# Altium schematic sheet CONNECTORS.SchDoc
size A4; SheetNumber: 2; SheetTotal: 7
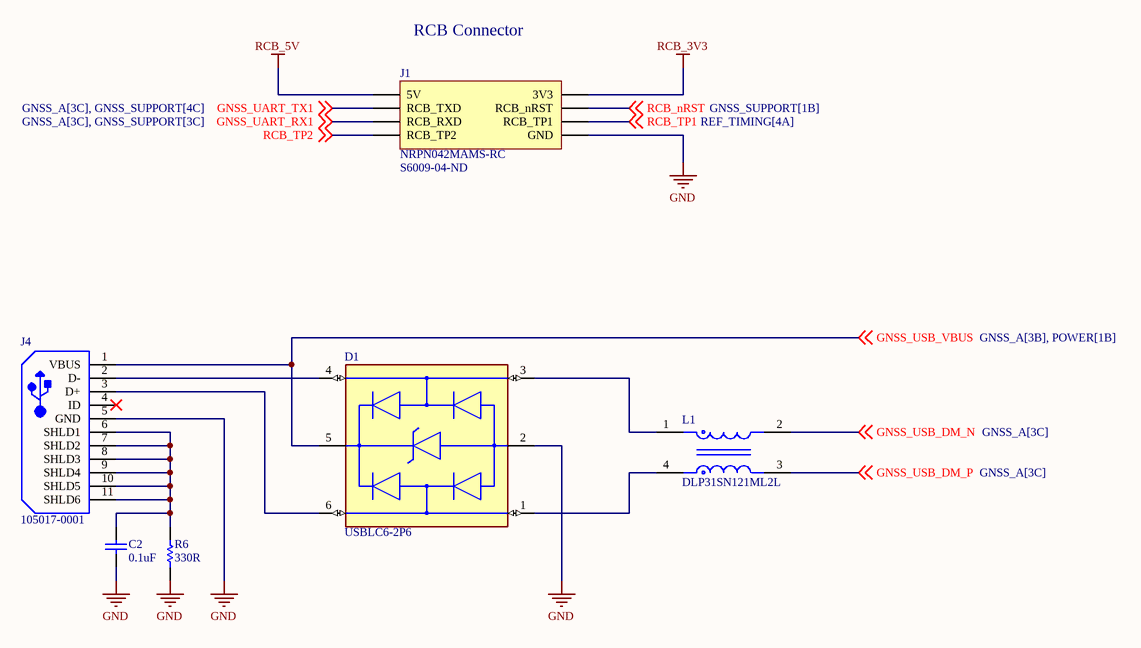
[diagram p0: CONNECTORS.SchDoc]

## Parts
C2  0.1uF  [CAPC1005X56X25LL10T15]
D1  USBLC6-2P6  [FP-SOT-666-MFG]
J1  NRPN042MAMS-RC  Supplier Part Number 1: S6009-04-ND  [NRPN042MAMS-RC]
J4  105017-0001  [USB-MICRO-B_V]
L1  DLP31SN121ML2L  [FP-DLP31SN-MFG]
R6  330R  [RESC1005X40X25ML05T05]

## Nets
GND: C2.1 D1.2(GND) J1.8(GND) J4.5(GND) R6.1
RCB_3V3: J1.2(3V3)
RCB_5V: J1.1(5V)
GNSS_UART_RX1: J1.5(RCB_RXD) ; off-sheet GNSS_UART_RX1
GNSS_UART_TX1: J1.3(RCB_TXD) ; off-sheet GNSS_UART_TX1
GNSS_USB_DM_N: L1.2 ; off-sheet GNSS_USB_DM_N
GNSS_USB_DM_P: L1.3 ; off-sheet GNSS_USB_DM_P
GNSS_USB_VBUS: D1.5(VBUS) J4.1(VBUS) ; off-sheet GNSS_USB_VBUS
RCB_nRST: J1.4(RCB_nRST) ; off-sheet RCB_nRST
RCB_TP1: J1.6(RCB_TP1) ; off-sheet RCB_TP1
RCB_TP2: J1.7(RCB_TP2) ; off-sheet RCB_TP2
NetC2_2: C2.2 J4.6(SHLD1) J4.7(SHLD2) J4.8(SHLD3) J4.9(SHLD4) J4.10(SHLD5) J4.11(SHLD6) R6.2
NetD1_1: D1.1(I/O1) L1.4
NetD1_3: D1.3(I/O2) L1.1
NetD1_4: D1.4(I/O2) J4.2(D-)
NetD1_6: D1.6(I/O1) J4.3(D+)

Not connected (* = marked no-connect by the designer): J4 4(ID)*

## Notes on the sheet
- RCB Connector

## Library data of the parts
C2 = CMP-2008-02743-1: Manufacturer: AVX Interconnect / Elco; Part Number: 04026D104KAT2A
D1 = CMP-12225-000058-1: TVS DIODE 5.25V 17V SOT666; Min Breakdown Voltage: 6V; Power Line Protection: Yes; Element Configuration: Dual; Test Current: 1mA; Working Voltage: 5V; Number of Channels: 2; Max Reverse Leakage Current: 150nA; Direction: Unidirectional; Peak Pulse Current: 5A; Number of Elements: 1; Capacitance: 3.5pF; Max Breakdown Voltage: 6V; Height: 0.6mm; Depth: 1.3mm; Contact Plating: Tin; Reverse Breakdown Voltage: 6V; REACH SVHC: No SVHC; Operating Supply Voltage: 5V; Width: 1.3mm; Max Operating Temperature: 125°C; Reverse Standoff Voltage: 5V; ESD Protection: Yes; Package Quantity: 1; Termination: SMD/SMT; Length: 1.7mm; Leakage Current: 150nA; Number of Bidirectional Channels: 2; Case/Package: SOT-666; Min Operating Temperature: -40°C; Number of Pins: 6; Clamping Voltage: 17V; Breakdown Voltage: 6V; Lead Free: Lead Free; Radiation Hardening: No; Packaging: Tape and Reel; Mount: Surface Mount; Polarity: Unidirectional
J1 = NRPN042MAMS-RC: Dual Row 8 Position 2 mm Pitch Surface Mount Header; Manufacturer: Sullins; Number of Positions: 8; Connector Type: Male Pin; Pitch: 0.079inch; Supplier 1: Digi-Key; Manufacturer Part Number: NRPN042MAMS-RC; RoHS: Yes; Category: Connectors; Stock 1: 10801; Pricing 1: 1=0.76000, 76=0.60237, 152=0.57618, 456=0.47143, 988=0.41904, 4940=0.37830 (USD); Mount: Surface Mount; Color: Black; Contact Plating: Gold; Contact Material: Brass; Housing Material: Nylon; Package Quantity: 1000; Number of Rows: 2; Packaging: Bulk; Termination: Solder; Contact Type: Male Pin; Length: 8mm; Width: 4mm; Height: 1.5mm; Row Spacing: 0.079inch; Contact Mating Length: 0.141inch; Lead Free: Lead Free; RoHS Compliant: Yes; ComponentLink1URL: https://datasheet.ciiva.com/711/nrpnxx2mamx-rc-10495-d-711179.pdf?src-supplier=Digi-Key; ComponentLink1Description: https://datasheet.ciiva.com/711/nrpnxx2mamx-rc-10495-d-711179.pdf?src-supplier=Digi-Key
J4 = CMP-2000-05827-1: Micro-USB B Receptacle, Right Angle, Bottom Mount, Surface Mount, with Solder Tabs, -30 to 85 degC, 5-Pin USB, RoHS, Tape and Reel; Manufacturer: Molex; Featured Product: Micro-USBConnectorsUSBConnectors; Other Names: WM1399DKR; Package Version: Rev. F, 12/2012; Number of Contacts: 5; Connector Type: USB-microB; Catalog Drawings: 1050170001; 3D Model: 105017-0001.stp; Mating Products: WM17145-ND-CABLEMICROUSBBTOSTDA1.0MWM17147-ND-CABLEMICROUSBBTOSTDA2.0MWM17146-ND-CABLEMICROUSBBTOSTDA1.5M; PCN Assembly/Origin: ResinSupplier21/Oct/2015; Voltage - Max: 30V; Online Catalog: Molex-MicroUSB; Manufacturer URL: http://www.molex.com/; Package Description: 5-Leads USB, Micro B, Body 7.5 x 5 mm, Pitch 0.65 mm; Datasheet URL: http://www.molex.com/elqNow/elqRedir.htm?ref=http://www.molex.com/webdocs/datasheets/pdf/en-us/1050170001_IO_CONNECTORS.pdf; Ingress Protection: -; Datasheet Version: 03/2016; Mounting Type: BoardCutout,SurfaceMount,RightAngle; Circuits: 5; Standard Package: 1; Package Reference: MICRO-B; Package URL: http://www.molex.com/pdm_docs/sd/1050170001_sd.pdf; Category: Connectors,Interconnects; Series: -; RoHS Information: 1050170001CertofCompliance; Features: Shielded,SolderRetention; Family: USB,DVI,HDMIConnectors; Specifications: -; Gender: Receptacle; Packaging: Digi-Reel®; Mounting Technology: SurfaceMount
L1 = CMP-06045-000038-1: CMC 100MA 2LN 120 OHM SMD; Number of Lines: 2; Impedance: 120R; Shielding: Unshielded; Voltage Rating: 16V; Tolerance: 20%; DC Resistance (DCR): 2R; Test Frequency: 100MHz; Packaging: Tape and Reel; Depth: 1.75mm; Max Operating Temperature: 85°C; Current: 100mA; DC Current: 100mA; Case Code (Metric): 3216; Radiation Hardening: No; Military Standard: Not; Min Operating Temperature: -40°C; Package Quantity: 1; Length: 3.2mm; Current Rating: 100mA; Max DC Current: 100mA; Height: 1.15mm; Lead Free: Lead Free; Termination: SMD/SMT; Case Code (Imperial): 1206; Case/Package: 1206; Width: 0.063inch; Mount: Surface Mount
R6 = CMP-2002-01143-1: Manufacturer: Panasonic; Part Number: ERJ2RKF3300X